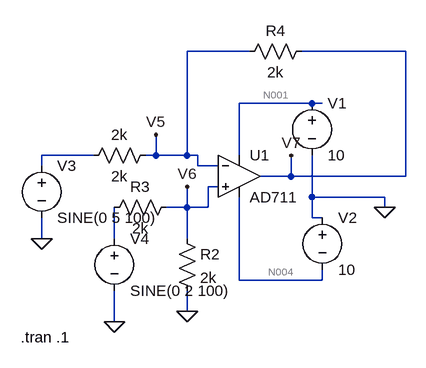
[diagram p0: schematic Differntial Amplifier using 2K.asc]
Differntial Amplifier using 2K.asc, the LTspice schematic file:
Version 4
SHEET 1 880 680
WIRE 224 -16 128 -16
WIRE 464 -16 304 -16
WIRE 320 64 208 64
WIRE 336 64 320 64
WIRE -16 144 -96 144
WIRE 80 144 80 112
WIRE 80 144 64 144
WIRE 128 144 128 -16
WIRE 128 144 80 144
WIRE 144 144 128 144
WIRE 208 144 208 64
WIRE -96 160 -96 144
WIRE 144 160 144 144
WIRE 176 160 144 160
WIRE 288 176 288 144
WIRE 288 176 240 176
WIRE 464 176 464 -16
WIRE 464 176 288 176
WIRE 176 192 160 192
WIRE 320 208 320 144
WIRE 432 208 320 208
WIRE 128 224 128 192
WIRE 128 224 96 224
WIRE 160 224 160 192
WIRE 160 224 128 224
WIRE 432 224 432 208
WIRE 320 240 320 208
WIRE 336 240 320 240
WIRE -96 272 -96 240
WIRE 16 272 16 224
WIRE 128 272 128 224
WIRE 208 336 208 208
WIRE 336 336 336 320
WIRE 336 336 208 336
WIRE 128 384 128 352
WIRE 16 400 16 352
FLAG 432 224 0
FLAG 128 384 0
FLAG -96 272 0
FLAG 16 400 0
FLAG 80 112 V5
FLAG 128 192 V6
FLAG 288 144 V7
SYMBOL OpAmps\\AD711 208 112 R0
SYMATTR InstName U1
SYMBOL voltage 320 48 R0
WINDOW 123 0 0 Left 0
WINDOW 39 0 0 Left 0
SYMATTR InstName V1
SYMATTR Value 10
SYMBOL voltage 336 224 R0
WINDOW 123 0 0 Left 0
WINDOW 39 0 0 Left 0
SYMATTR InstName V2
SYMATTR Value 10
SYMBOL res 80 128 R90
WINDOW 0 0 56 VBottom 2
WINDOW 3 32 56 VTop 2
SYMATTR InstName 2k
SYMATTR Value 2k
SYMATTR SpiceLine tol=1 pwr=.25
SYMBOL res 112 208 R90
WINDOW 0 0 56 VBottom 2
WINDOW 3 32 56 VTop 2
SYMATTR InstName R3
SYMATTR Value 2k
SYMATTR SpiceLine tol=1 pwr=.25
SYMBOL res 320 -32 R90
WINDOW 0 0 56 VBottom 2
WINDOW 3 32 56 VTop 2
SYMATTR InstName R4
SYMATTR Value 2k
SYMATTR SpiceLine tol=1 pwr=.25
SYMBOL res 112 256 R0
SYMATTR InstName R2
SYMATTR Value 2k
SYMATTR SpiceLine tol=1 pwr=.25
SYMBOL voltage -96 144 R0
WINDOW 123 0 0 Left 0
WINDOW 39 0 0 Left 0
SYMATTR InstName V3
SYMATTR Value SINE(0 5 100)
SYMBOL voltage 16 256 R0
WINDOW 123 0 0 Left 0
WINDOW 39 0 0 Left 0
SYMATTR InstName V4
SYMATTR Value SINE(0 2 100)
TEXT -128 424 Left 2 !.tran .1

The netlist it stands for:
* Differntial Amplifier using 2K.asc
XU1 V6 V5 N001 N004 V7 AD712  ; AD711, pins In+ In- V+ V- OUT
V1 N001 0 10
V2 0 N004 10
R§2k V5 N002 2k tol=1 pwr=.25
R3 V6 N003 2k tol=1 pwr=.25
R4 V7 V5 2k tol=1 pwr=.25
R2 V6 0 2k tol=1 pwr=.25
V3 N002 0 SINE(0 5 100)
V4 N003 0 SINE(0 2 100)
.tran .1
.lib ADI1.lib
.backanno
.end

* Results of the author's LTspice run, read from the files saved beside the schematic
* Operating Point, zero values left out:
*   V(v5) = -25 nV
*   V(v6) = -25 nV
*   V(n001) = 10 V
*   V(n004) = -10 V
*   I(2k) = -12.5 pA
*   I(R3) = -12.5 pA
*   I(R4) = 12.5 pA
*   I(R2) = -12.5 pA
*   I(V1) = -4.704 mA
*   I(V2) = -4.704 mA
*   I(V3) = -12.5 pA
*   I(V4) = -12.5 pA
*   Ix(u1:1) = 25 pA
*   Ix(u1:2) = 25 pA
*   Ix(u1:3) = 4.704 mA
*   Ix(u1:4) = -4.704 mA
*   Ix(u1:5) = -12.5 pA
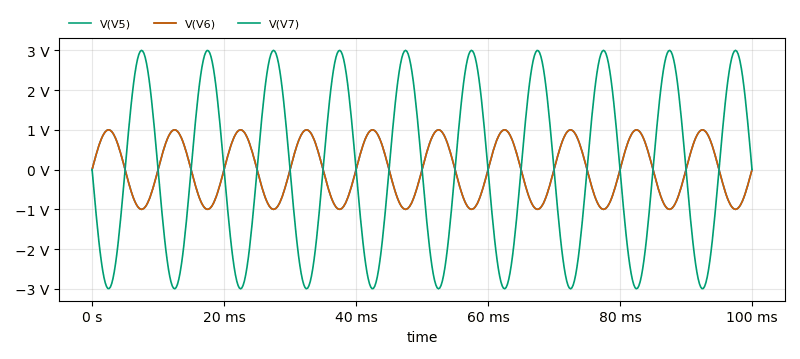
[diagram p1: Transient Analysis of Differntial Amplifier using 2K.asc, plotted from the saved traces]
* Transient Analysis, 1 run:
*   V(V5): min -999.1 mV, max 999.1 mV, average -678.9 nV, rms 706.5 mV, last 72.78 µV
*   V(V6): min -999.1 mV, max 999.1 mV, average -679.7 nV, rms 706.5 mV, last -1.747 µV
*   V(V7): min -2.997 V, max 2.997 V, average 1.965 µV, rms 2.119 V, last 149.1 µV